# EAGLE design I2C_decagon2.0 (EAGLE 8.4.0)
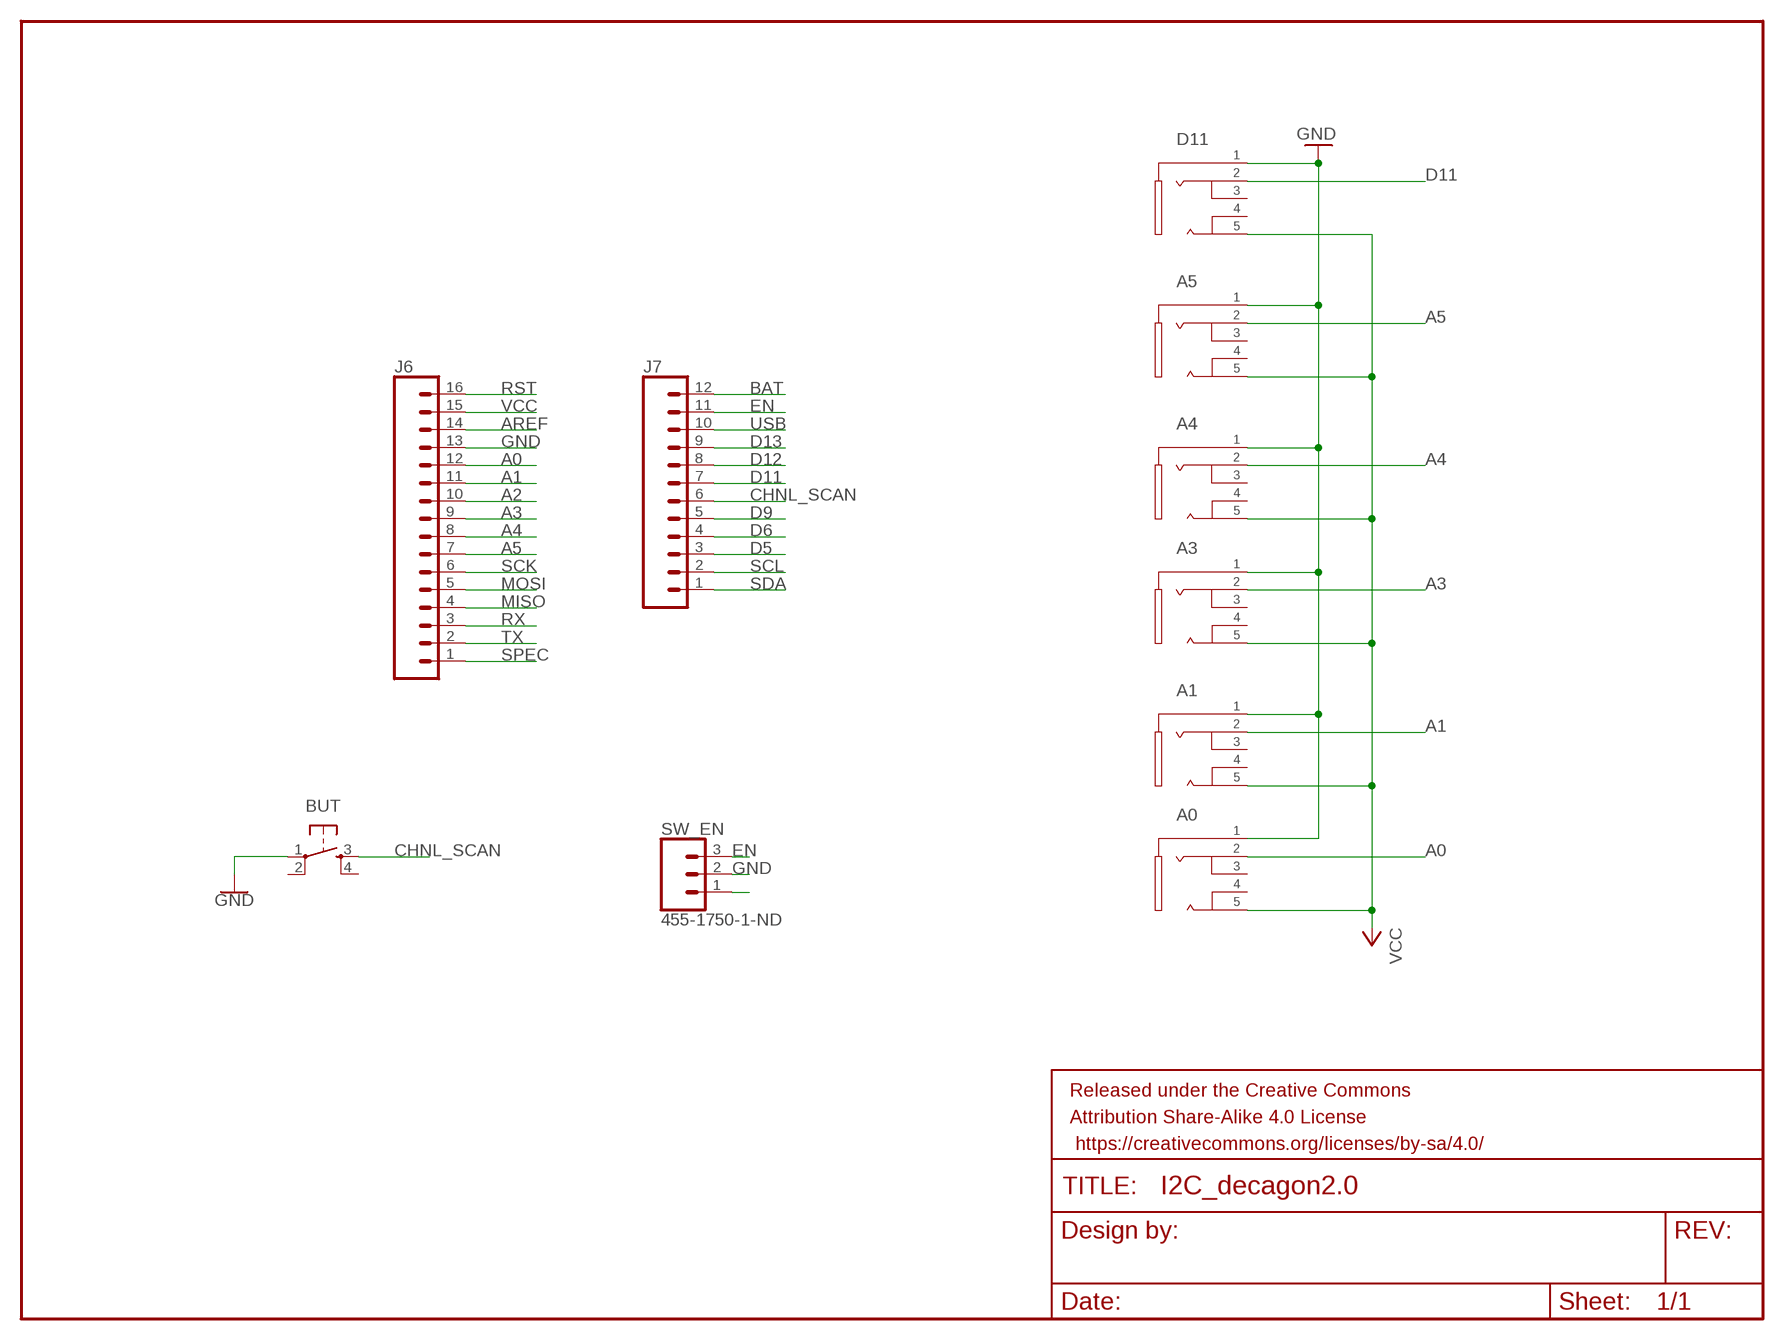
[diagram p0: schematic, sheet 1]

## Parts
A0  JW-PJ-307-5H  [JW-PJ-307-5H]
A1  JW-PJ-307-5H  [JW-PJ-307-5H]
A3  JW-PJ-307-5H  [JW-PJ-307-5H]
A4  JW-PJ-307-5H  [JW-PJ-307-5H]
A5  JW-PJ-307-5H  [JW-PJ-307-5H]
BUT  TAC_SWITCHPTH  [TACTILE-PTH]
D11  JW-PJ-307-5H  [JW-PJ-307-5H]
FRAME1  FRAME-LETTER  [CREATIVE_COMMONS]
J6  CONN_16  [1X16]
J7  CONN_12  [1X12]
SW_EN  455-1750-1-ND  CONN_03  [1X03]

## Nets
A0: A0.2 J6.12
A1: A1.2 J6.11
A2: J6.10
A3: A3.2 J6.9
A4: A4.2 J6.8
A5: A5.2 J6.7
AREF: J6.14
BAT: J7.12
CHNL_SCAN: BUT.3 J7.6
D5: J7.3
D6: J7.4
D9: J7.5
D11: D11.2 J7.7
D12: J7.8
D13: J7.9
EN: J7.11 SW_EN.3
GND: A0.1 A1.1 A3.1 A4.1 A5.1 BUT.1 D11.1 J6.13 SW_EN.2
MISO: J6.4
MOSI: J6.5
N$3: SW_EN.1
RST: J6.16
RX: J6.3
SCK: J6.6
SCL: J7.2
SDA: J7.1
SPEC: J6.1
TX: J6.2
USB: J7.10
VCC: A0.5 A1.5 A3.5 A4.5 A5.5 D11.5 J6.15
Unconnected: A0.3 A0.4 A1.3 A1.4 A3.3 A3.4 A4.3 A4.4 A5.3 A5.4 BUT.2 BUT.4 D11.3 D11.4

## Library data of the parts
A0 A1 A3-A5 D11 = jack:JW-PJ-307-5
BUT = SparkFun-Retired:TAC_SWITCH: Momentary Switch Button commonly used for reset or general input. Spark Fun Electronics SKU : COM-00097 SMT- SWCH-08247
FRAME1 = SparkFun-Aesthetics:FRAME-LETTER: Schematic Frame - Letter Standard 8.5x11 US Letter frame
J6 = SparkFun-Connectors:CONN_16: Multi connection point. Often used as Generic Header-pin footprint for 0.1 inch spaced/style header connections On any of the 0.1 inch spaced packages, you can populate with these: Break Away Headers - Straight <https://www.sparkfun.com/products/116> (PRT-00116) Break Away Male Headers - Right Angle <https://www.sparkfun.com/products/553> (PRT-00553) Female Headers <https://www.sparkfun.com/products/115> (PRT-00115) Break Away Headers - Machine Pin <https://www.sparkfun.com/products/117> (PRT-00117) Break Away Female Headers - Swiss Machine Pin <https://www.sparkfun.com/products/743> (PRT-00743) For SCREWTERMINALS and SPRING TERMINALS visit here: Screw Terimnals on SparkFun.com <https://www.sparkfun.com/search/results?term=Screw+Terminals> (5mm/3.5mm/2.54mm spacing) This device is also useful as a general connection point to wire up your design to another part of your project. Our various solder wires solder well into these plated through hole pads. Hook-Up Wire - Assortment (Stranded, 22 AWG) <https://www.sparkfun.com/products/11375> (PRT-11375) Hook-Up Wire - Assortment (Solid Core, 22 AWG) <https://www.sparkfun.com/products/11367> (PRT-11367) View the entire wire category on our website here <https://www.sparkfun.com/categories/141> Special notes: Molex polarized connector foot print use with SKU : PRT-08231 with associated crimp pins and housings. 1MM SMD Version SKU: PRT-10208 NOTES ON THE VARIANTS LOCK and LOCK_LONGPADS... This footprint was designed to help hold the alignment of a through-hole component (i.e. 6-pin header) while soldering it into place. You may notice that each hole has been shifted either up or down by 0.005 of an inch from it's more standard position (which is a perfectly straight line). This slight alteration caused the pins (the squares in the middle) to touch the edges of the holes. Because they are alternating, it causes a "brace" to hold the component in place. 0.005 has proven to be the perfect amount of "off-center" position when using our standard breakaway headers. Although looks a little odd when you look at the bare footprint, once you have a header in there, the alteration is very hard to notice. Also,if you push a header all the way into place, it is covered up entirely on the bottom side.
J7 = SparkFun-Connectors:CONN_12: Multi connection point. Often used as Generic Header-pin footprint for 0.1 inch spaced/style header connections On any of the 0.1 inch spaced packages, you can populate with these: Break Away Headers - Straight <https://www.sparkfun.com/products/116> (PRT-00116) Break Away Male Headers - Right Angle <https://www.sparkfun.com/products/553> (PRT-00553) Female Headers <https://www.sparkfun.com/products/115> (PRT-00115) Break Away Headers - Machine Pin <https://www.sparkfun.com/products/117> (PRT-00117) Break Away Female Headers - Swiss Machine Pin <https://www.sparkfun.com/products/743> (PRT-00743) For SCREWTERMINALS and SPRING TERMINALS visit here: Screw Terimnals on SparkFun.com <https://www.sparkfun.com/search/results?term=Screw+Terminals> (5mm/3.5mm/2.54mm spacing) This device is also useful as a general connection point to wire up your design to another part of your project. Our various solder wires solder well into these plated through hole pads. Hook-Up Wire - Assortment (Stranded, 22 AWG) <https://www.sparkfun.com/products/11375> (PRT-11375) Hook-Up Wire - Assortment (Solid Core, 22 AWG) <https://www.sparkfun.com/products/11367> (PRT-11367) View the entire wire category on our website here <https://www.sparkfun.com/categories/141> Special notes: Molex polarized connector foot print use with SKU : PRT-08231 with associated crimp pins and housings. 1MM SMD Version SKU: PRT-10208 NOTES ON THE VARIANTS LOCK and LOCK_LONGPADS... This footprint was designed to help hold the alignment of a through-hole component (i.e. 6-pin header) while soldering it into place. You may notice that each hole has been shifted either up or down by 0.005 of an inch from it's more standard position (which is a perfectly straight line). This slight alteration caused the pins (the squares in the middle) to touch the edges of the holes. Because they are alternating, it causes a "brace" to hold the component in place. 0.005 has proven to be the perfect amount of "off-center" position when using our standard breakaway headers. Although looks a little odd when you look at the bare footprint, once you have a header in there, the alteration is very hard to notice. Also,if you push a header all the way into place, it is covered up entirely on the bottom side.
SW_EN = SparkFun-Connectors:CONN_03: Multi connection point. Often used as Generic Header-pin footprint for 0.1 inch spaced/style header connections On any of the 0.1 inch spaced packages, you can populate with these: Break Away Headers - Straight <https://www.sparkfun.com/products/116> (PRT-00116) Break Away Male Headers - Right Angle <https://www.sparkfun.com/products/553> (PRT-00553) Female Headers <https://www.sparkfun.com/products/115> (PRT-00115) Break Away Headers - Machine Pin <https://www.sparkfun.com/products/117> (PRT-00117) Break Away Female Headers - Swiss Machine Pin <https://www.sparkfun.com/products/743> (PRT-00743) Stackable Header - 3 Pin (Female, 0.1") <https://www.sparkfun.com/products/13875> (PRT-13875) For SCREWTERMINALS and SPRING TERMINALS visit here: Screw Terimnals on SparkFun.com <https://www.sparkfun.com/search/results?term=Screw+Terminals> (5mm/3.5mm/2.54mm spacing) This device is also useful as a general connection point to wire up your design to another part of your project. Our various solder wires solder well into these plated through hole pads. Hook-Up Wire - Assortment (Stranded, 22 AWG) <https://www.sparkfun.com/products/11375> (PRT-11375) Hook-Up Wire - Assortment (Solid Core, 22 AWG) <https://www.sparkfun.com/products/11367> (PRT-11367) View the entire wire category on our website here <https://www.sparkfun.com/categories/141> Special notes: Molex polarized connector foot print use with SKU : PRT-08232 with associated crimp pins and housings.; PROD_ID: XXX-00000

## Net classes
0 default: width 0.406 mm
1 ground: width 0.61 mm

## Board
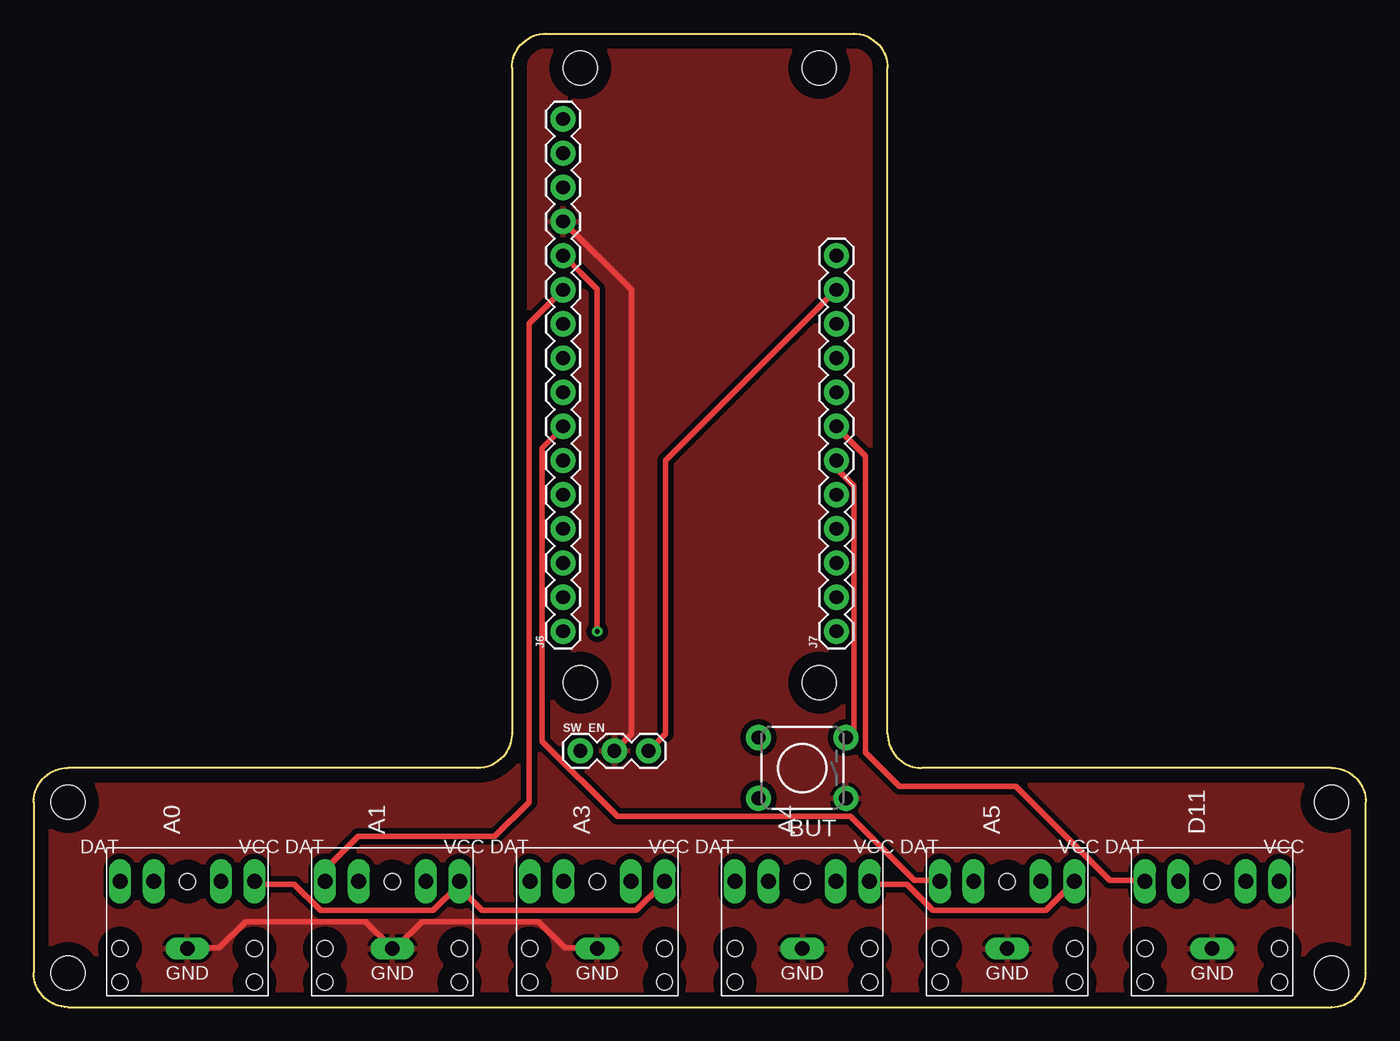
[diagram p1: board, top side]
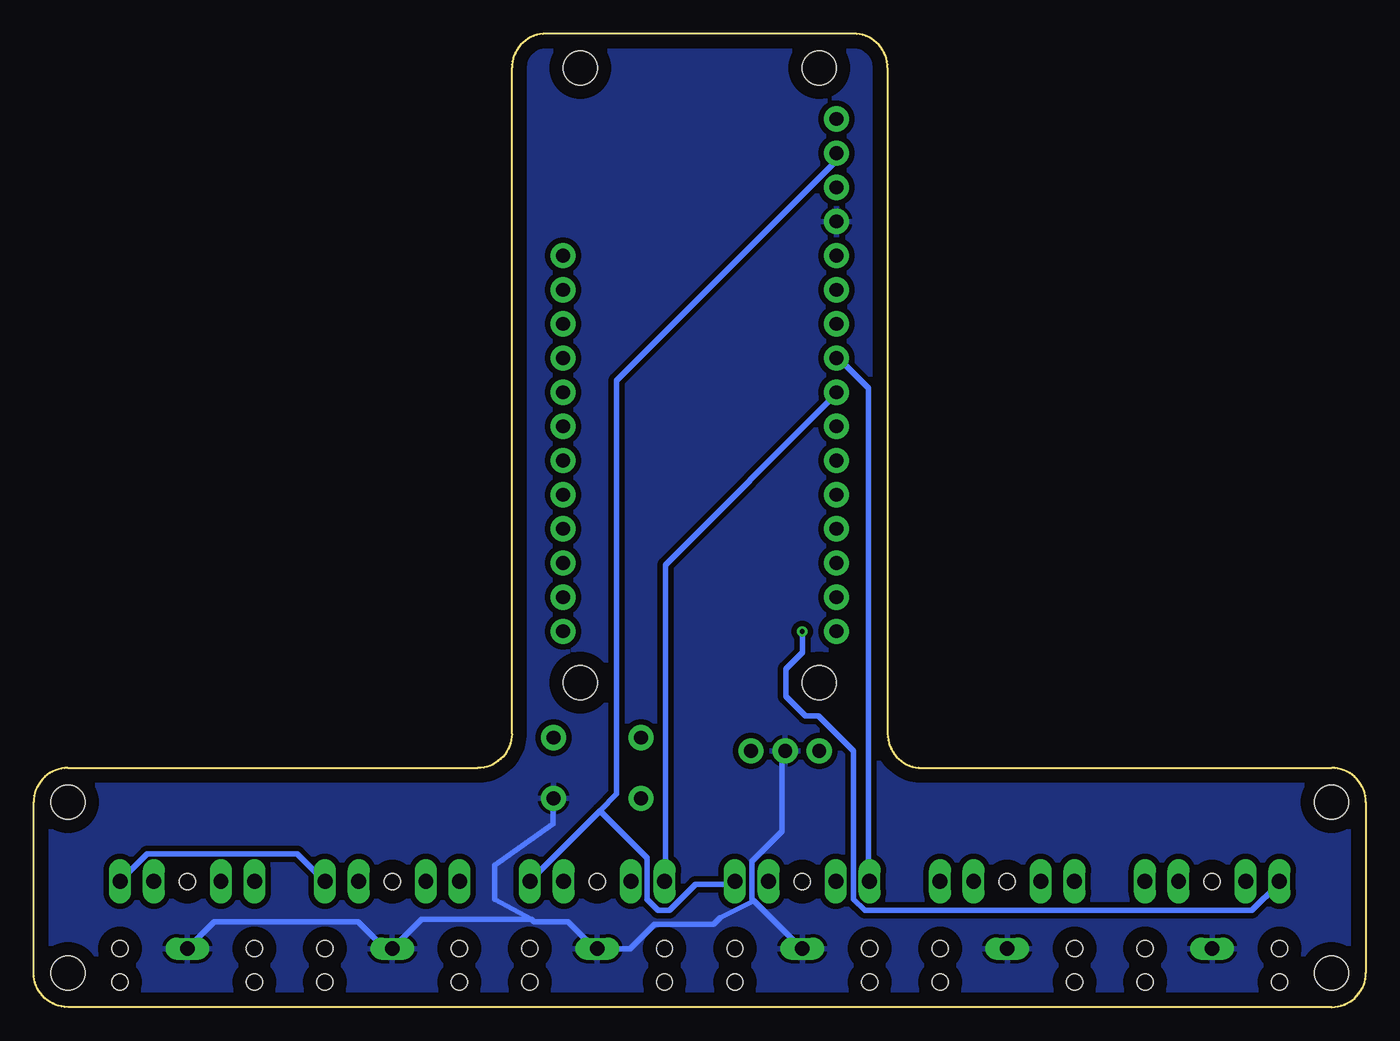
[diagram p2: board, bottom side, seen from below]

Size 99.06 x 72.39 mm. Coordinates in mm from the lower left corner, seen from the top.
Outline: 2.54,0 96.52,0 arc90 99.06,2.54 99.06,15.24 arc90 96.52,17.78 66.04,17.78 arc-90 63.5,20.32 63.5,69.85 arc90 60.96,72.39 38.1,72.39 arc90 35.56,69.85 35.56,20.32 arc-90 33.02,17.78 2.54,17.78 arc90 0,15.24 0,2.54 arc90 2.54,0
Copper layers (1*16): Top 0.035mm / dielectric 1.5mm / Bottom 0.035mm
Design rules "default": minimum track width 6mil, minimum drill 0.35mm, track to track 6mil, track to pad 6mil, pad to pad 6mil, via to via 6mil, smd to smd 6mil, copper to edge 40mil, drill to drill 6mil, minimum pad ring 10mil, minimum via ring 8mil, stop-mask expansion 4mil, vias tented up to drill 0mil, thermal gap 10mil
Holes 2.54 mm at 58.42,24.13 40.64,24.13 40.64,69.85 58.42,69.85 96.52,15.24 96.52,2.54 2.54,15.24 2.54,2.54

### Footprints (pad centres in the part's own frame; a part is rotated, then mirrored left to right if it is on the bottom)
JW-PJ-307-5H = drill 1.1 long: 1 -2,0; 2 3,5; 3 3,2.5; 4 3,-2.5; 5 3,-5 | hole 1.2: -4.5,5; -2,5; 3,0; -4.5,-5; -2,-5
TACTILE-PTH = drill 1.016 pad 1.88: 1 -3.251,2.261; 2 3.251,2.261; 3 -3.251,-2.261; 4 3.251,-2.261
1X16 = drill 1.016 pad 1.88: 1 0,0; 2 2.54,0; 3 5.08,0; 4 7.62,0; 5 10.16,0; 6 12.7,0; 7 15.24,0; 8 17.78,0; 9 20.32,0; 10 22.86,0; 11 25.4,0; 12 27.94,0; 13 30.48,0; 14 33.02,0; 15 35.56,0; 16 38.1,0
1X12 = drill 1.016 pad 1.88: 1 0,0; 2 2.54,0; 3 5.08,0; 4 7.62,0; 5 10.16,0; 6 12.7,0; 7 15.24,0; 8 17.78,0; 9 20.32,0; 10 22.86,0; 11 25.4,0; 12 27.94,0
1X03 = drill 1.016 pad 1.88: 1 0,0; 2 2.54,0; 3 5.08,0

### Placement (x,y rotation side)
A0  11.43,6.35 90 top
A1  26.67,6.35 90 top
A3  41.91,6.35 90 top
A4  57.15,6.35 90 top
A5  72.39,6.35 90 top
BUT  57.15,17.78 180 top
D11  87.63,6.35 90 top
FRAME1  -83.82,27.94 0 top  (outside the outline)
J6  39.37,27.94 90 top
J7  59.69,27.94 90 top
SW_EN  40.64,19.05 0 top

### Tracks (layer width: path | path; a pad name or v marks a point on that pad's centre or on a via)
A0  (via drill 0.35)
  Top 0.406: 40.66,54.63 39.5,55.8 J6.12 | 40.89,54.41 41.91,53.39 v41.91,27.94 | 40.66,54.63 40.89,54.41 | 40.66,54.63 40.89,54.41
  Bottom 0.406: A0.2 6.53,9.14 8.48,7.19 37.26,7.19 38.1,8.03 38.1,19.05 40.69,21.64 41.67,21.64 43.13,23.1 43.13,25.16 41.91,26.38 v41.91,27.94
A1
  Top 0.406: J6.11 36.85,50.83 36.85,19.78 36.83,19.76 36.83,15.24 34.29,12.7 24.13,12.7 21.67,10.24 A1.2
A3
  Bottom 0.406: A3.2 36.98,9.42 36.98,46.02 39.22,48.26 J6.9
A4
  Bottom 0.406: A4.2 52.07,9.42 52.07,32.89 39.5,45.47 J6.8
A5
  Top 0.406: A5.2 67.16,9.42 65.48,9.42 60.73,14.17 43.41,14.17 37.82,19.76 37.82,41.55 39.22,42.95 J6.7
CHNL_SCAN
  Top 0.406: J7.6 59.89,40.44 59.89,39.88 61.01,38.76 61.01,20.6 60.45,20.04 BUT.3
D11
  Top 0.406: D11.2 82.52,9.42 80.01,9.42 73.02,16.41 64.36,16.41 61.85,18.92 61.85,41 59.89,42.95 J7.7
EN
  Top 0.406: 45.92,19.2 SW_EN.3 46.99,20.32 46.99,40.64 J7.11 59.61,53.29
GND
  Top 0.406: A0.1 11.56,4.39 13.79,4.39 15.75,6.35 24.69,6.35 26.64,4.39 A1.1 26.92,4.39 28.88,6.35 37.54,6.35 39.5,4.39 41.73,4.39 A3.1 | J6.13 44.45,53.34 44.45,20.32 SW_EN.2
  Bottom 0.406: BUT.1 60.45,15.29 60.45,13.61 64.8,10.54 64.8,8.03 62.04,6.54 | 45.5,7.89 42.01,4.39 A3.1 | 45.5,7.89 45.64,8.03 45.64,10.82 43.41,13.06 43.41,18.92 SW_EN.2 | 45.5,7.89 48.03,6.63 48.49,6.17 52.9,6.17 54.72,4.35 57.33,4.35 | 57.1,4.39 A4.1 57.33,4.35 | 62.04,6.54 61.85,6.35 59.33,6.35 57.33,4.35 | 62.04,6.54 70.2,6.54 A5.1 72.93,4.35 74.93,6.35 85.63,6.35 D11.1
  pour Bottom (isolate 0.406): 35.56,69.85 arc-90 38.1,72.39 39.37,72.39 59.69,72.39 arc-90 63.5,68.58 63.5,20.32 arc90 66.04,17.78 67.31,17.78 96.52,17.78 arc-90 99.06,15.24 99.06,11.43 99.06,2.54 arc-90 96.52,0 95.25,0 2.54,0 arc-90 0,2.54 0,15.24 arc-90 2.54,17.78 3.81,17.78 33.02,17.78 arc90 35.56,20.32
  pour Top (isolate 0.406): 31.75,17.78 33.02,17.78 arc90 35.56,20.32 35.56,69.85 arc-90 38.1,72.39 60.96,72.39 arc-90 63.5,69.85 63.5,20.32 arc113 67.31,17.78 95.25,17.78 96.52,17.78 arc-90 99.06,15.24 99.06,13.97 99.06,2.54 arc-90 96.52,0 95.25,0 2.54,0 arc-90 0,2.54 0,15.24 arc-90 2.54,17.78
VCC
  Top 0.406: A0.5 16.59,9.14 19.38,9.14 21.34,7.19 29.72,7.19 31.67,9.14 A1.5 31.67,8.86 33.35,7.19 44.81,7.19 46.76,9.14 A3.5 | A4.5 62.41,9.14 64.92,9.14 66.88,7.19 75.26,7.19 77.22,9.14 A5.5
  Bottom 0.406: D11.5 92.58,9.42 90.63,11.38 79.45,11.38 77.5,9.42 A5.5 | 56.96,14.59 62.13,9.42 A4.5 | 56.96,14.59 55.7,15.85 55.7,46.58 39.5,62.79 39.5,63.35 J6.15 | 56.96,14.59 53.47,11.1 53.47,8.03 52.63,7.19 51.79,7.19 49.84,9.14 47.04,9.14 A3.5

### Text on the board
tPlace: DAT | VCC | DAT | VCC | DAT | VCC | DAT | VCC | DAT | VCC | DAT | VCC | GND | GND | GND | GND | GND | GND